# EAGLE design a26-flashcart (EAGLE 7.0.0)
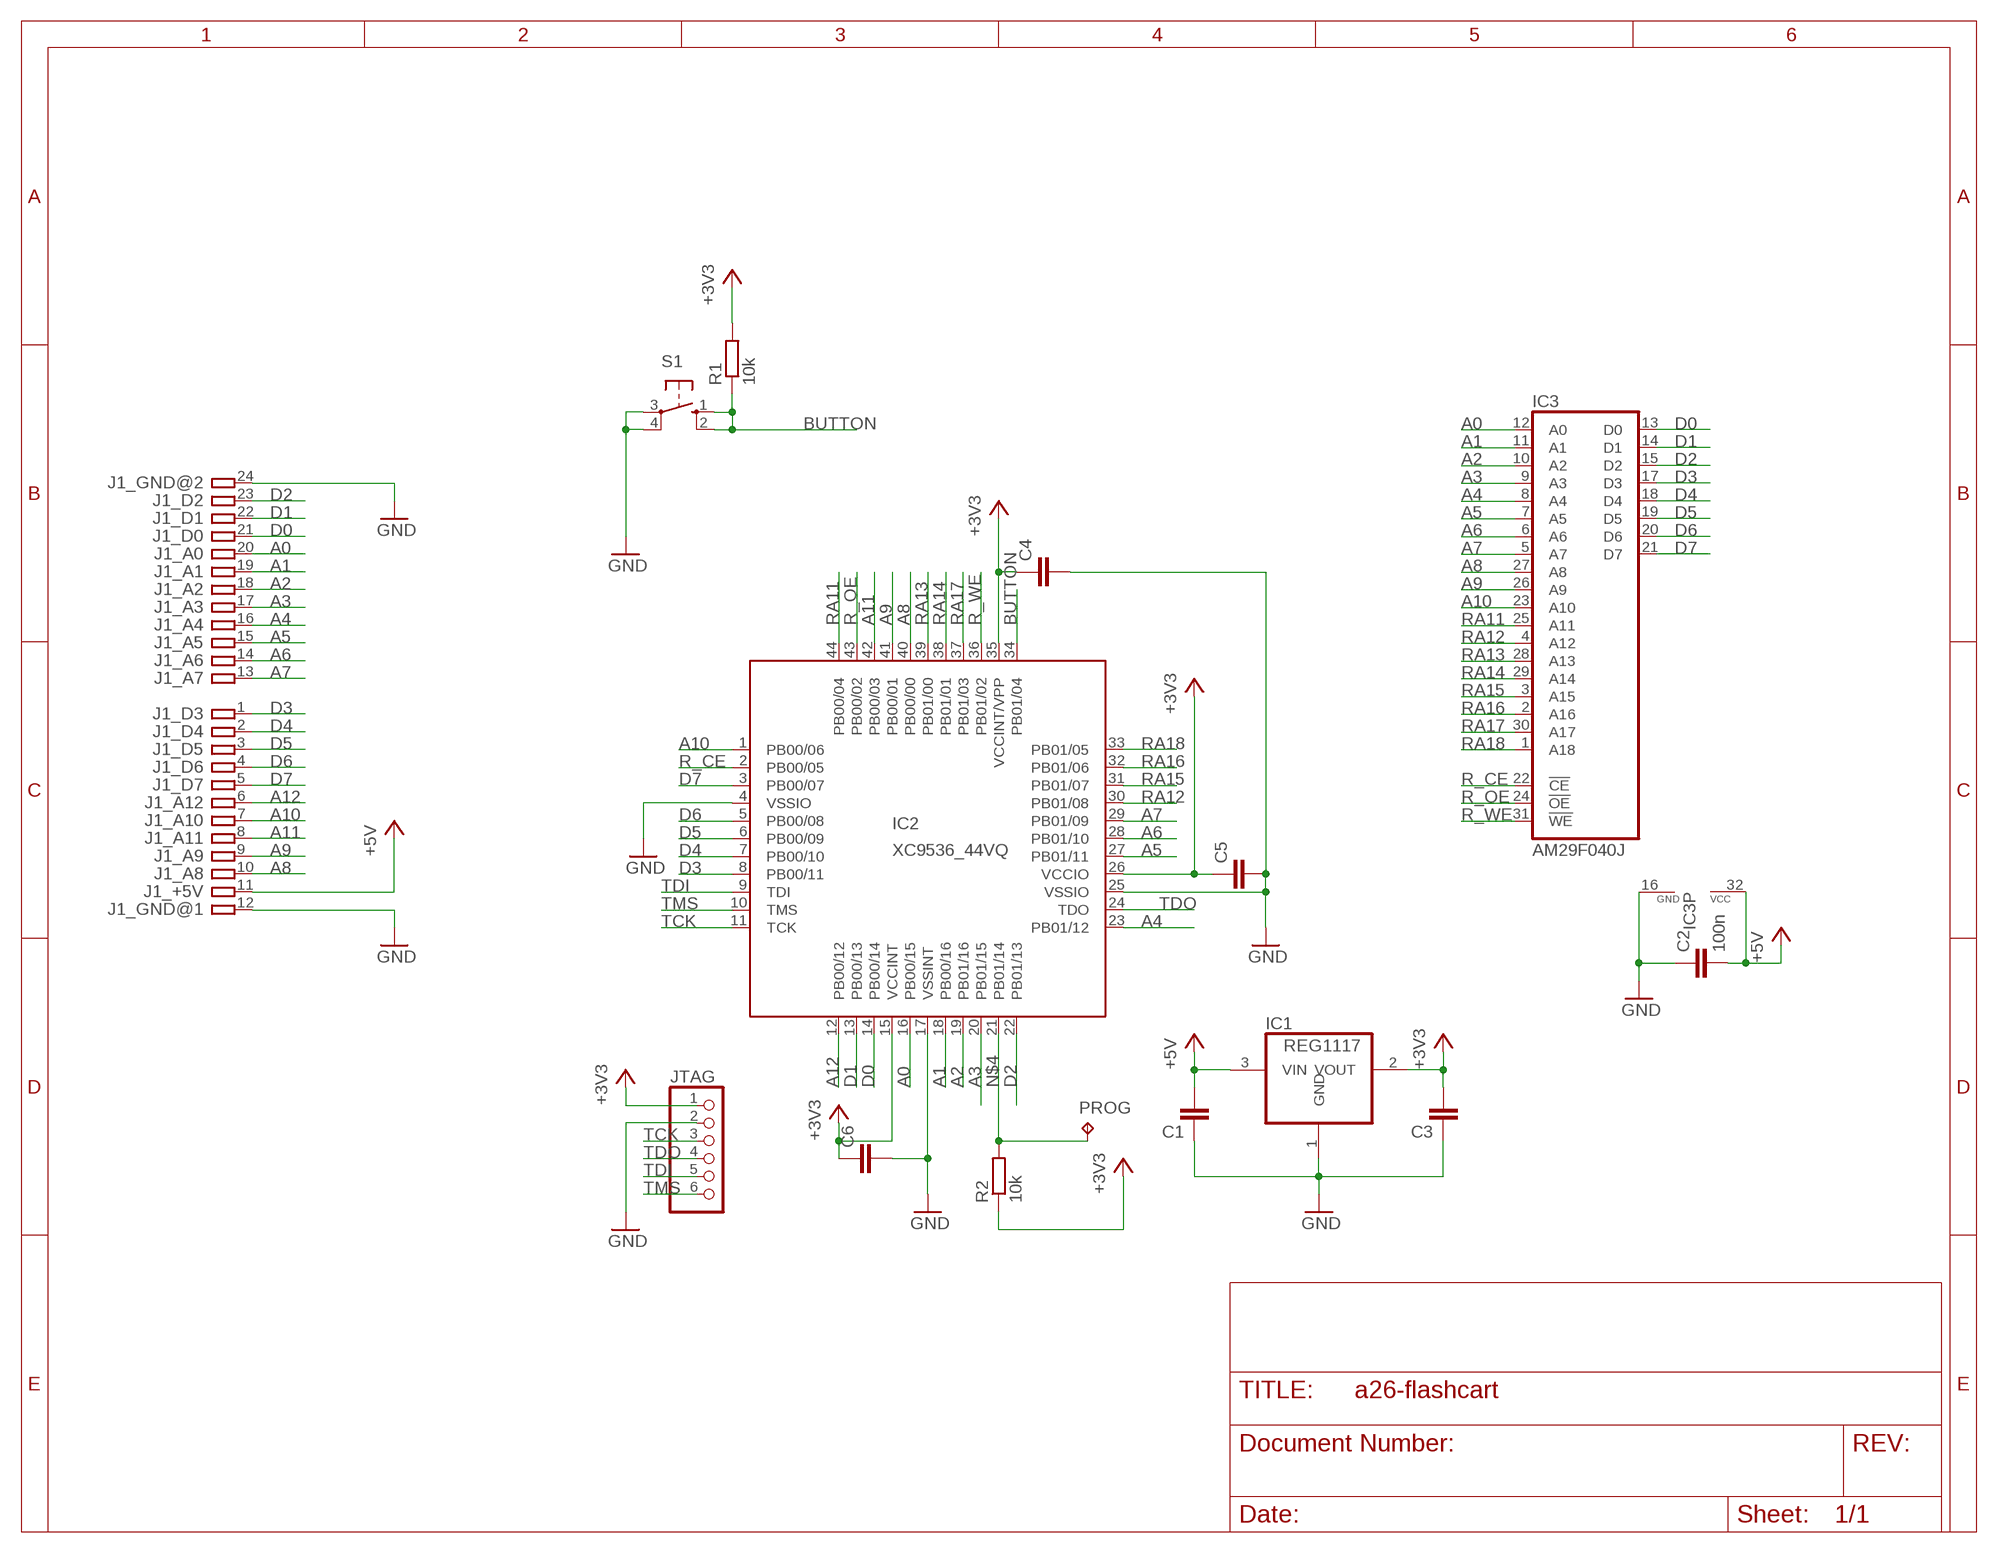
[diagram p0: schematic, sheet 1]

## Parts
C1  C-EUC0603  [C0603]
C2  100n  C-EUC0603  [C0603]
C3  C-EUC0603  [C0603]
C4  C-EUC0603  [C0603]
C5  C-EUC0603  [C0603]
C6  C-EUC0603  [C0603]
IC1  REG1117  [SOT223]
IC2  XC9536_44VQ  [SQFP-S-10X10-44]
IC3  AM29F040J  [PLCC32R]
J1  ATARI-2600-SMALL  [ATARI-2600-SMALL]
JTAG  PINHD-1X6  [1X06]
PROG  TPTP15R  [TP15R]
R1  10k  R-EU_R0603  [R0603]
R2  10k  R-EU_R0603  [R0603]
S1  10-XX  [B3F-10XX]

## Nets
+3V3: C3.2 C4.1 C5.1 C6.1 IC1.2(VOUT) IC2.15(VCCINT) IC2.26(VCCIO) IC2.35(VCCINT/VPP) JTAG.1 R1.2 R2.1
+5V: C1.2 C2.2 IC1.3(VIN) IC3.32(VCC) J1.11
A0: IC2.16(PB00/15) IC3.12(A0) J1.20
A1: IC2.18(PB00/16) IC3.11(A1) J1.19
A2: IC2.19(PB01/16) IC3.10(A2) J1.18
A3: IC2.20(PB01/15) IC3.9(A3) J1.17
A4: IC2.23(PB01/12) IC3.8(A4) J1.16
A5: IC2.27(PB01/11) IC3.7(A5) J1.15
A6: IC2.28(PB01/10) IC3.6(A6) J1.14
A7: IC2.29(PB01/09) IC3.5(A7) J1.13
A8: IC2.40(PB00/00) IC3.27(A8) J1.10
A9: IC2.41(PB00/01) IC3.26(A9) J1.9
A10: IC2.1(PB00/06) IC3.23(A10) J1.7
A11: IC2.42(PB00/03) J1.8
A12: IC2.12(PB00/12) J1.6
BUTTON: IC2.34(PB01/04) R1.1 S1.1(S) S1.2(S1)
D0: IC2.14(PB00/14) IC3.13(D0) J1.21
D1: IC2.13(PB00/13) IC3.14(D1) J1.22
D2: IC2.22(PB01/13) IC3.15(D2) J1.23
D3: IC2.8(PB00/11) IC3.17(D3) J1.1
D4: IC2.7(PB00/10) IC3.18(D4) J1.2
D5: IC2.6(PB00/09) IC3.19(D5) J1.3
D6: IC2.5(PB00/08) IC3.20(D6) J1.4
D7: IC2.3(PB00/07) IC3.21(D7) J1.5
GND: C1.1 C2.1 C3.1 C4.2 C5.2 C6.2 IC1.1(GND) IC2.4(VSSIO) IC2.17(VSSINT) IC2.25(VSSIO) IC3.16(GND) J1.12 J1.24 JTAG.2 S1.3(P) S1.4(P1)
N$4: IC2.21(PB01/14) PROG.TP R2.2
R_CE: IC2.2(PB00/05) IC3.22(!CE)
R_OE: IC2.43(PB00/02) IC3.24(!OE)
R_WE: IC2.36(PB01/02) IC3.31(!WE)
RA11: IC2.44(PB00/04) IC3.25(A11)
RA12: IC2.30(PB01/08) IC3.4(A12)
RA13: IC2.39(PB01/00) IC3.28(A13)
RA14: IC2.38(PB01/01) IC3.29(A14)
RA15: IC2.31(PB01/07) IC3.3(A15)
RA16: IC2.32(PB01/06) IC3.2(A16)
RA17: IC2.37(PB01/03) IC3.30(A17)
RA18: IC2.33(PB01/05) IC3.1(A18)
TCK: IC2.11(TCK) JTAG.3
TDI: IC2.9(TDI) JTAG.5
TDO: IC2.24(TDO) JTAG.4
TMS: IC2.10(TMS) JTAG.6

## Library data of the parts
C1-C6 = resistor:C-EU: CAPACITOR, European symbol
IC1 = burr-brown:REG1117: 800mA and 1A Low Dropout (LDO) Positive Regulator 1.8V, 2.5V, 2.85V, 3.3V, 5V, and Adj; MPN: REG1117; OC_FARNELL: 1097566; OC_NEWARK: 14P6981
IC2 = xilinx-xc9:XC9536_44VQ: xc9536_pc44 XC9500 In-System Programmable CPLD Family Auto generated by make-symbol-device-package-bsdl.ulp Rev. 34 Source: xc9536_vq44.bsd; MPN: XC9536-15VQG44C; OC_FARNELL: 1193227; OC_NEWARK: 98K3377
IC3 = am29-memory:AM29F040J: 4-Megabit FLASH MEMORY (512 K x 8 bit) 5 V-only
J1 = atari-2600:ATARI-2600: Atari 2600 cartridge board
JTAG = adafruit:PINHD-1X6: PIN HEADER
PROG = testpad:TP: Test pad
R1 R2 = resistor:R-EU_: RESISTOR, European symbol
S1 = switch-omron:10-XX: OMRON SWITCH; MPN: B3F-1000; OC_FARNELL: 176432; OC_NEWARK: 36M3542

## Board
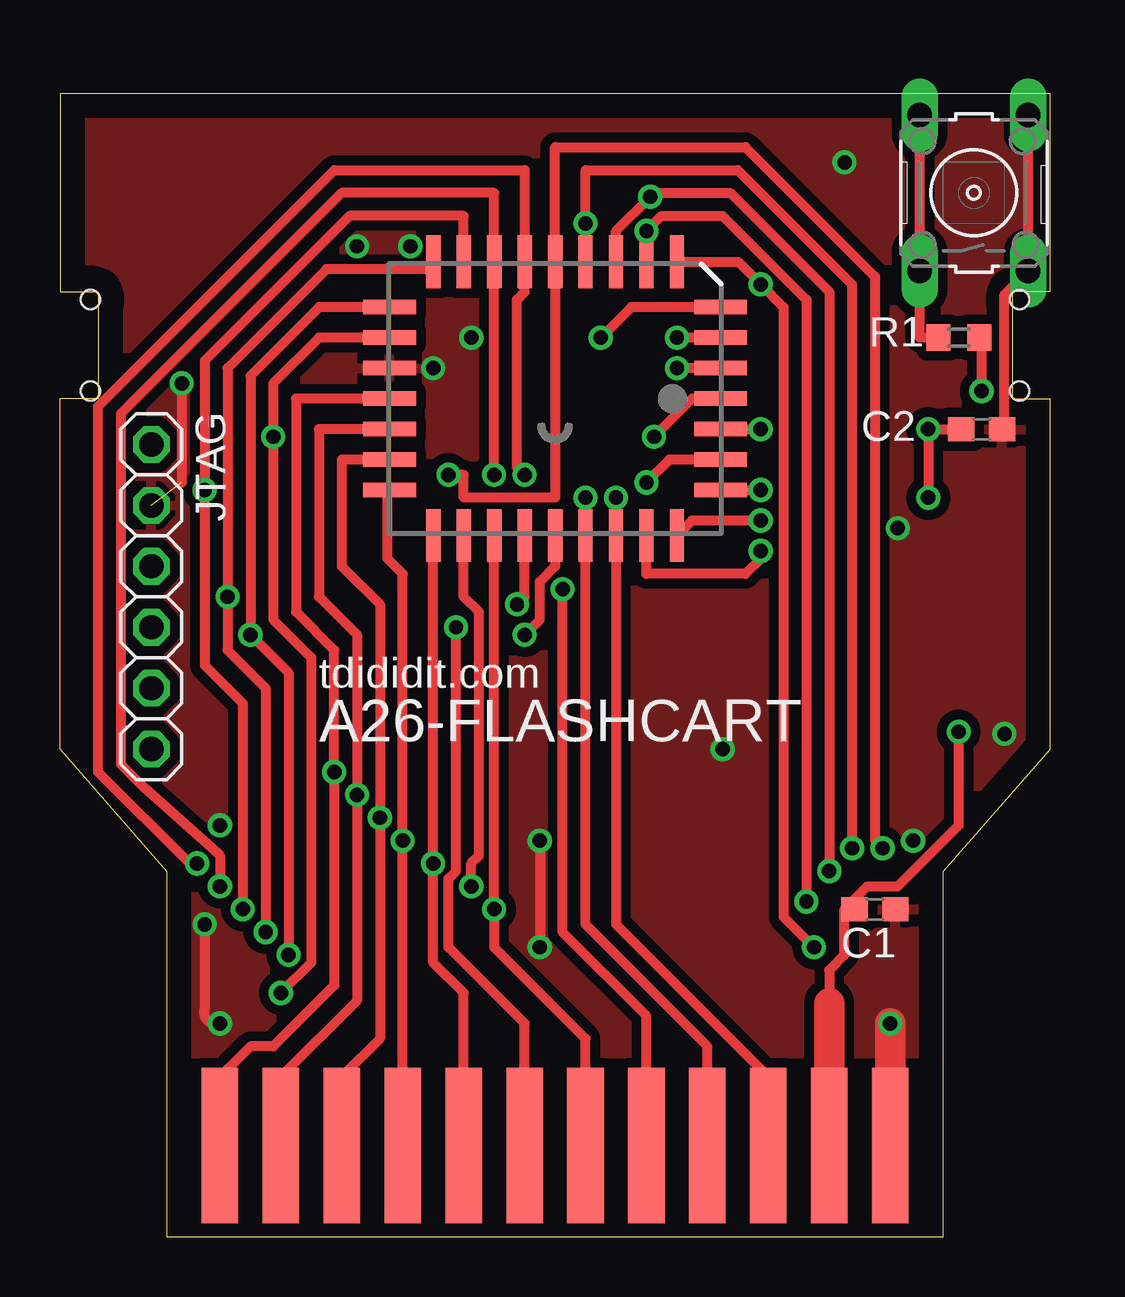
[diagram p1: board, top side]
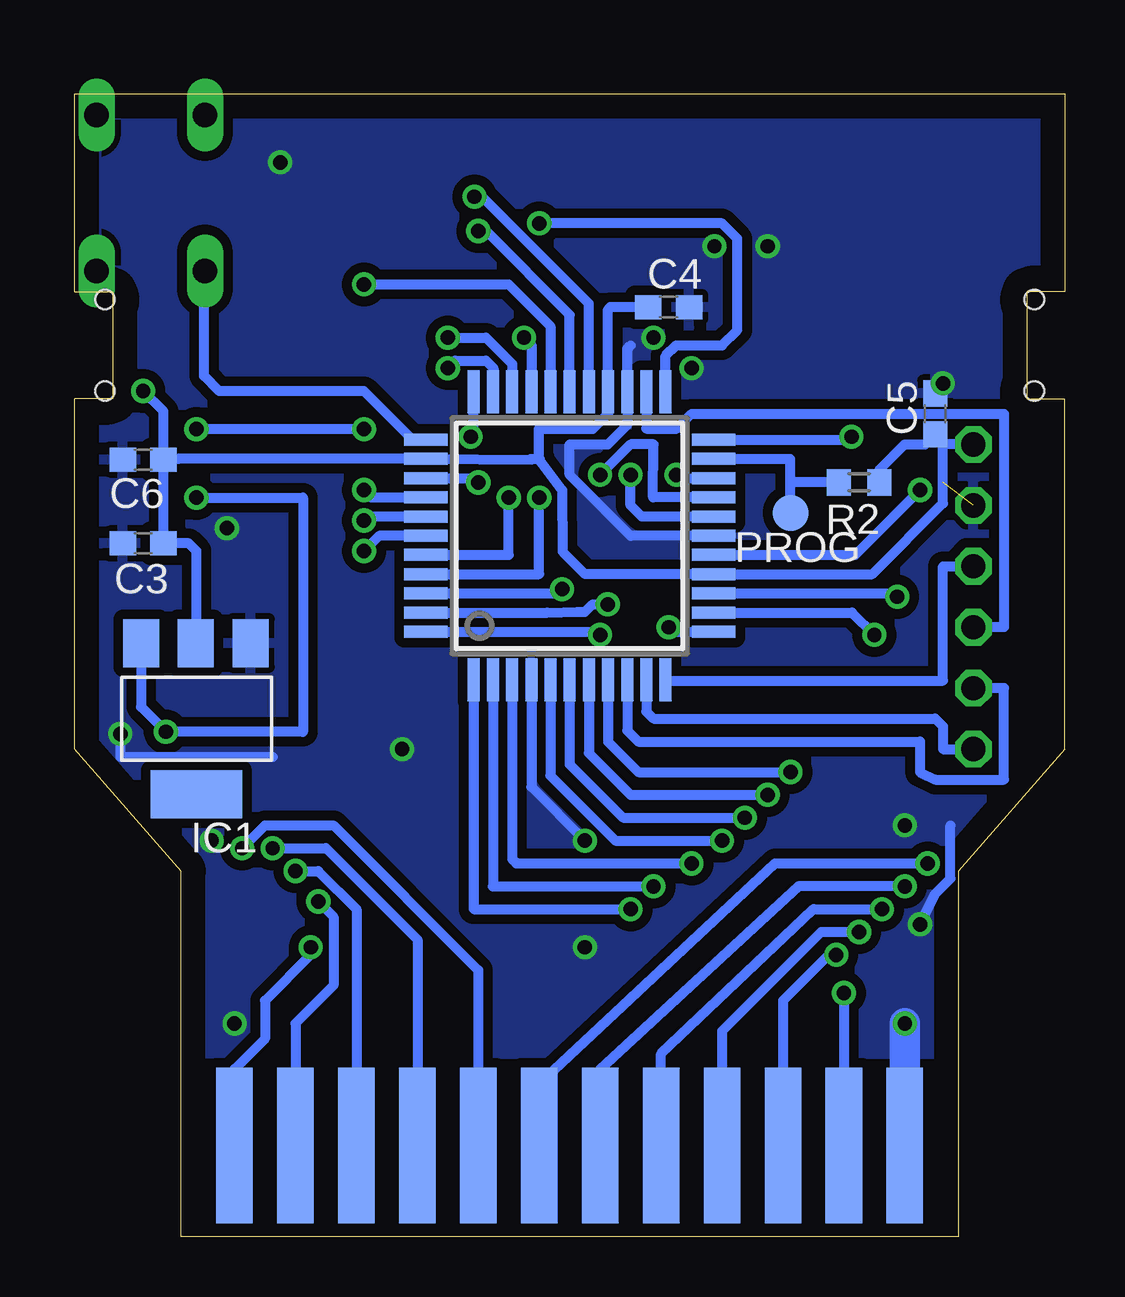
[diagram p2: board, bottom side, seen from below]

Size 41.27 x 47.62 mm. Coordinates in mm from the lower left corner, seen from the top.
Copper layers (1*16): Top 0.035mm / dielectric 1.5mm / Bottom 0.035mm
Design rules "default": minimum track width 10mil, minimum drill 24mil, track to track 8mil, track to pad 8mil, pad to pad 8mil, via to via 8mil, smd to smd 8mil, copper to edge 40mil, drill to drill 8mil, minimum pad ring 10mil, minimum via ring 8mil, stop-mask expansion 4mil, vias tented up to drill 0mil, thermal gap 10mil

### Footprints (pad centres in the part's own frame; a part is rotated, then mirrored left to right if it is on the bottom)
C0603 = smd 1.1 x 1: 1 -0.85,0; 2 0.85,0
SOT223 = smd 1.499 x 2.007: 1 -2.261,-3.15; 2 0.025,-3.15; 3 2.311,-3.15 | smd 3.81 x 2.007: 4 0,3.15
SQFP-S-10X10-44 = smd 0.5 x 1.8: 1 -4,-6; 2 -3.2,-6; 3 -2.4,-6; 4 -1.6,-6; 5 -0.8,-6; 6 0,-6; 7 0.8,-6; 8 1.6,-6; 9 2.4,-6; 10 3.2,-6; 11 4,-6; 23 4,6; 24 3.2,6; 25 2.4,6; 26 1.6,6; 27 0.8,6; 28 0,6; 29 -0.8,6; 30 -1.6,6; 31 -2.4,6; 32 -3.2,6; 33 -4,6 | smd 1.8 x 0.5: 12 6,-4; 13 6,-3.2; 14 6,-2.4; 15 6,-1.6; 16 6,-0.8; 17 6,0; 18 6,0.8; 19 6,1.6; 20 6,2.4; 21 6,3.2; 22 6,4; 34 -6,4; 35 -6,3.2; 36 -6,2.4; 37 -6,1.6; 38 -6,0.8; 39 -6,0; 40 -6,-0.8; 41 -6,-1.6; 42 -6,-2.4; 43 -6,-3.2; 44 -6,-4
PLCC32R = smd 0.6 x 2.2: 1 0,6.9; 2 -1.27,6.9; 3 -2.54,6.9; 4 -3.81,6.9; 14 -3.81,-6.9; 15 -2.54,-6.9; 16 -1.27,-6.9; 17 0,-6.9; 18 1.27,-6.9; 19 2.54,-6.9; 20 3.81,-6.9; 30 3.81,6.9; 31 2.54,6.9; 32 1.27,6.9 | smd 2.2 x 0.6: 5 -5.7,5.08; 6 -5.7,3.81; 7 -5.7,2.54; 8 -5.7,1.27; 9 -5.7,0; 10 -5.7,-1.27; 11 -5.7,-2.54; 12 -5.7,-3.81; 13 -5.7,-5.08; 21 5.7,-5.08; 22 5.7,-3.81; 23 5.7,-2.54; 24 5.7,-1.27; 25 5.7,0; 26 5.7,1.27; 27 5.7,2.54; 28 5.7,3.81; 29 5.7,5.08
ATARI-2600-SMALL = smd 1.524 x 6.477: 1 -13.97,3.81; 2 -11.43,3.81; 3 -8.89,3.81; 4 -6.35,3.81; 5 -3.81,3.81; 6 -1.27,3.81; 7 1.27,3.81; 8 3.81,3.81; 9 6.35,3.81; 10 8.89,3.81; 11 11.43,3.81; 12 13.97,3.81 | smd 1.524 x 6.477 bottom: 13 13.97,3.81; 14 11.43,3.81; 15 8.89,3.81; 16 6.35,3.81; 17 3.81,3.81; 18 1.27,3.81; 19 -1.27,3.81; 20 -3.81,3.81; 21 -6.35,3.81; 22 -8.89,3.81; 23 -11.43,3.81; 24 -13.97,3.81 | hole 0.8: -19.367,39.053; -19.367,35.242; 19.367,39.053; 19.367,35.242
1X06 = drill 1.016 octagon: 1 -6.35,0; 2 -3.81,0; 3 -1.27,0; 4 1.27,0; 5 3.81,0; 6 6.35,0
TP15R = smd 1.5 x 1.5: TP 0,0
R0603 = smd 1 x 1.1: 1 -0.85,0; 2 0.85,0
B3F-10XX = drill 1.016 long: 1 -3.251,2.261; 2 3.251,2.261; 3 -3.251,-2.261; 4 3.251,-2.261

### Placement (x,y rotation side)
C1  33.97,13.65 180 top
C2  38.42,33.66 180 top
C3  38.42,28.89 0 bottom
C4  16.51,38.73 0 bottom
C5  5.4,34.29 90 bottom
C6  38.42,32.38 180 bottom
IC1  36.2,21.59 180 bottom
IC2  20.64,29.21 0 bottom
IC3  20.64,34.93 270 top
J1  20.64,0 0 top
JTAG  3.81,26.67 270 top
PROG  11.43,30.16 0 bottom
R1  37.47,37.47 0 top
R2  8.57,31.43 180 bottom
S1  38.1,43.5 90 top

### Tracks (layer width: path | path; a pad name or v marks a point on that pad's centre or on a via)
+3V3  (via drill 0.6)
  Top 0.406: v38.42,35.24 38.42,37.36 R1.2
  Bottom 0.406: C6.1 36.96,32.41 IC2.35 22.23,32.38 | 22.25,32.41 22.23,32.38 | 22.23,32.38 22.2,32.41 21.93,32.41 | 21.93,32.41 21.88,32.41 | 21.93,32.41 21.91,32.38 20.96,31.12 20.93,28.55 19.99,27.61 IC2.15 8.03,27.61 5.08,30.56 5.08,33.02 | IC1.2 36.2,24.76 36.2,28.58 36.51,28.89 C3.2 C6.1 | C6.1 37.57,34.39 v38.42,35.24 | C4.1 18.95,38.73 19.04,38.65 IC2.26 19.04,34.3 19.68,33.65 21.93,33.65 21.93,32.41 | JTAG.1 5.08,33.02 | 5.08,33.02 C5.1 5.82,33.02 6.67,33.02 7.72,31.97 R2.1
+5V  (via drill 0.6)
  Top 0.406: 32.7,13.65 32.7,11.75 32.07,11.11 32.07,8.57 | 32.7,13.65 33.66,14.6 34.92,14.6 37.47,17.15 v37.47,21.04 | v36.2,30.8 v36.2,33.65 C2.2 | IC3.32 v29.21,33.65 | C1.2 32.7,13.65
  Top 1.27: J1.11 32.07,8.57 32.07,9.74
  Bottom 0.406: 37.78,21.04 v37.47,21.04 | v36.2,30.8 31.75,30.8 31.75,21.04 v37.47,21.04 | v29.21,33.65 v36.2,33.65 | IC1.3 38.51,22.09 v37.47,21.04
A0  (via drill 0.6)
  Top 0.406: IC3.12 16.83,42.55 12.06,42.55 6.03,36.51 v6.03,31.12 6.03,23.81 7.62,22.22 v7.62,13.65
  Bottom 0.406: J1.20 16.83,7.62 10.48,13.65 v7.62,13.65 | IC2.16 8.74,28.41 v6.03,31.12
A1  (via drill 0.6)
  Top 0.406: v6.67,14.6 6.67,15.87 6.35,16.19 3.49,18.73 2.54,19.69 2.54,34.29 11.75,43.5 18.1,43.5 IC3.11 v18.1,31.75
  Bottom 0.406: v6.67,14.6 11.11,14.6 19.37,6.98 J1.19 | IC2.18 17.63,30.01 18.1,30.48 v18.1,31.75
A2  (via drill 0.6)
  Top 0.406: v5.71,15.56 5.4,15.56 1.59,19.37 1.59,34.61 11.43,44.45 19.37,44.45 IC3.10 19.37,39.37 19.05,39.05 19.05,32.07 v19.37,31.75
  Bottom 0.406: J1.18 21.91,6.35 12.06,15.56 v5.71,15.56 | IC2.19 17.16,30.81 17.14,33.02 18.1,33.02 v19.37,31.75
A3  (via drill 0.6)
  Top 0.406: v34.29,16.19 33.97,16.51 33.97,40.01 28.58,45.4 20.64,45.4 IC3.9 20.64,30.8 16.83,30.8 16.83,31.75 v16.19,31.75
  Bottom 0.406: v34.29,16.19 33.34,17.15 30.48,17.15 24.45,11.11 J1.17 | v16.19,31.75 16.05,31.61 IC2.20
A4  (via drill 0.6)
  Top 0.406: v33.02,16.19 33.02,39.69 28.26,44.45 21.91,44.45 v21.91,42.23 IC3.8
  Bottom 0.406: v33.02,16.19 30.8,16.19 26.99,12.38 J1.16 | IC2.23 16.64,36.7 16.19,37.15 14.29,37.15 13.65,37.78 13.65,41.59 14.29,42.23 v21.91,42.23
A5  (via drill 0.6)
  Top 0.406: IC3.7 23.18,41.91 v24.61,43.34 24.77,43.5 27.94,43.5 32.07,39.37 v32.07,15.24
  Bottom 0.406: v32.07,15.24 31.12,15.24 29.53,13.65 J1.15 | IC2.27 19.84,38.89 24.29,43.34 v24.61,43.34
A6  (via drill 0.6)
  Top 0.406: v31.12,13.97 31.12,39.05 27.62,42.55 25.08,42.55 v24.45,41.91 IC3.6
  Bottom 0.406: v31.12,13.97 30.48,13.33 30.48,10.48 32.07,8.89 J1.14 | IC2.28 20.64,38.42 24.13,41.91 v24.45,41.91
A7  (via drill 0.6)
  Top 0.406: v31.43,12.06 30.16,13.33 30.16,38.73 v29.21,39.69 28.27,40.62 IC3.5
  Bottom 0.406: v31.43,12.06 31.43,11.75 33.34,9.84 33.34,8.25 34.61,6.98 J1.13 | v29.21,39.69 23.18,39.69 21.44,37.95 IC2.29
A8  (via drill 0.6)
  Top 0.406: J1.10 29.53,6.67 23.18,13.02 IC3.27 v23.18,30.8
  Bottom 0.406: IC2.40 23.18,28.41 v23.18,30.8
A9  (via drill 0.6)
  Top 0.406: J1.9 26.99,7.94 21.91,13.02 IC3.26 v21.91,30.8
  Bottom 0.406: IC2.41 21.91,27.61 v21.91,30.8
A10  (via drill 0.6)
  Top 0.406: J1.7 21.91,8.25 18.1,12.06 v18.1,13.65 IC3.23
  Bottom 0.406: IC2.1 24.64,13.65 v18.1,13.65
A11  (via drill 0.6)
  Top 0.406: J1.8 24.45,9.21 20.96,12.7 v20.96,26.99
  Bottom 0.406: IC2.42 21.09,26.81 v20.96,26.99
A12  (via drill 0.6)
  Top 0.406: J1.6 19.37,8.89 16.19,12.06 16.19,14.92 16.51,15.24 v16.51,25.4
  Bottom 0.406: v16.51,25.4 16.38,25.21 IC2.12
BUTTON
  Top 0.406: R1.1 35.84,37.47 S1.1 S1.2
  Bottom 0.406: IC2.34 27.18,33.21 29.21,35.24 35.24,35.24 35.88,35.88 35.88,40.21 S1.1
D0  (via drill 0.6)
  Top 0.406: IC3.13 15.25,40.32 11.11,40.32 6.98,36.19 v6.98,26.67 6.98,24.45 8.57,22.86 v8.57,12.7
  Bottom 0.406: v8.57,12.7 10.16,12.7 14.29,8.57 J1.21 | IC2.14 7.12,26.81 v6.98,26.67
D1  (via drill 0.6)
  Top 0.406: IC3.14 10.79,38.73 7.94,35.88 v7.94,25.08 9.53,23.49 v9.53,11.75
  Bottom 0.406: v9.53,11.75 9.84,11.75 11.75,9.84 J1.22 | IC2.13 8.86,26.01 v7.94,25.08
D2  (via drill 0.6)
  Top 0.406: IC3.15 10.79,37.47 8.89,35.56 v8.89,33.34 8.89,25.72 10.48,24.13 10.48,11.43 v9.21,10.16
  Bottom 0.406: v9.21,10.16 J1.23 | IC2.22 9.02,33.21 v8.89,33.34
D3  (via drill 0.6)
  Top 0.406: IC3.17 9.84,34.93 9.84,26.03 11.43,24.45 v11.43,19.37 11.43,10.48 8.89,7.94 7.94,7.94 6.98,6.98 6.98,4.13 J1.1
  Bottom 0.406: IC2.8 19.04,20.62 17.78,19.37 v11.43,19.37
D4  (via drill 0.6)
  Top 0.406: IC3.18 10.79,33.65 10.79,26.67 12.38,25.08 v12.38,18.42 12.38,9.84 9.21,6.67 J1.2
  Bottom 0.406: IC2.7 19.84,20.15 18.1,18.42 v12.38,18.42
D5  (via drill 0.6)
  Top 0.406: IC3.19 11.75,32.38 11.75,27.94 13.34,26.35 v13.34,17.46 13.34,8.25 11.75,6.67 J1.3
  Bottom 0.406: IC2.6 20.64,19.69 18.41,17.46 v13.34,17.46
D6  (via drill 0.6)
  Top 0.406: J1.4 v14.29,16.51 14.29,27.62 13.65,28.26 13.65,31.03 IC3.20
  Bottom 0.406: IC2.5 21.44,19.21 18.73,16.51 v14.29,16.51
D7  (via drill 0.6)
  Top 0.406: J1.5 16.83,10.16 15.56,11.43 v15.56,15.56 IC3.21
  Bottom 0.406: IC2.3 23.04,15.74 22.86,15.56 v15.56,15.56
GND  (via drill 0.6)  (1 unrouted)
  Top 0.406: v6.03,13.02 6.03,9.53 arc90 6.35,8.89 v6.67,8.89 | C2.1 arc90 39.37,33.76 39.37,39.26 S1.3 S1.4 | v20,16.51 v20,12.06 | v5.08,35.56 5.08,31.43
  Top 1.27: J1.12 v34.61,8.89
  Bottom 0.406: v39.37,20.96 39.37,20 33.02,20 | 18.1,37.15 18.24,37.01 IC2.25 18.24,33.83 19.05,33.02 20.64,33.02 20.64,31.75 18.1,29.21 IC2.17 | C4.2 15.56,38.73 | v6.03,13.02 5.4,14.29 4.76,14.92 4.76,17.15 | IC2.4 22.24,18.74 v20,16.51 | v5.08,35.56 5.4,35.24 C5.2
  Bottom 1.27: J1.24 v6.67,8.89
  other vias: 34.92,29.53 35.56,16.51 6.67,17.15 15.56,36.2 14.61,41.27 12.38,41.27 27.62,20.32 17.14,37.47 32.7,44.77
  pour Top (isolate 0.406): 0.32,48.26 40.96,48.26 40.96,19.05 37.15,15.24 37.15,7.62 4.13,7.62 4.13,16.51 0.32,20.32
  pour Bottom (isolate 0.406): 0.32,48.26 40.96,48.26 40.96,19.05 37.15,15.24 37.15,7.62 4.13,7.62 4.13,16.51 0.32,20.32
N$4
  Bottom 0.406: IC2.21 11.45,32.41 11.45,31.43 | 11.45,31.43 11.45,30.19 PROG.TP | R2.2 11.45,31.43
R_CE  (via drill 0.6)
  Top 0.406: v17.14,14.6 17.14,15.56 17.46,15.87 17.46,26.03 16.83,26.67 IC3.22
  Bottom 0.406: IC2.2 23.84,14.6 v17.14,14.6
R_OE  (via drill 0.6)
  Top 0.406: v19.05,26.35 19.37,26.67 IC3.24
  Bottom 0.406: IC2.43 21.57,26.01 20.32,26.03 20,26.03 19.68,26.35 v19.05,26.35
R_WE  (via drill 0.6)
  Top 0.406: IC3.31 25.4,32.38 v24.45,31.43
  Bottom 0.406: IC2.36 24.59,31.61 v24.45,31.43
RA11  (via drill 0.6)
  Top 0.406: IC3.25 20.64,27.94 20,27.3 20,25.72 v19.37,25.08
  Bottom 0.406: IC2.44 19.56,25.21 v19.37,25.08
RA12  (via drill 0.6)
  Top 0.406: IC3.4 23.81,38.73 v22.54,37.47
  Bottom 0.406: v22.54,37.47 22.24,37.16 IC2.30
RA13  (via drill 0.6)
  Top 0.406: v29.21,28.58 29.21,28.26 28.58,27.62 24.45,27.62 IC3.28
  Bottom 0.406: IC2.39 28.58,29.21 v29.21,28.58
RA14  (via drill 0.6)
  Top 0.406: v29.21,29.85 26.34,29.85 IC3.29
  Bottom 0.406: IC2.38 29.05,30.01 v29.21,29.85
RA15  (via drill 0.6)
  Top 0.406: IC3.3 v25.72,37.47
  Bottom 0.406: v25.72,37.47 24.13,37.47 23.04,36.37 IC2.31
RA16  (via drill 0.6)
  Top 0.406: IC3.2 v25.72,36.19
  Bottom 0.406: v25.72,36.19 25.4,36.51 24.13,36.51 23.81,36.19 23.81,35.23 IC2.32
RA17  (via drill 0.6)
  Top 0.406: IC3.30 v29.21,31.12
  Bottom 0.406: v29.21,31.12 28.91,30.81 IC2.37
RA18  (via drill 0.6)
  Top 0.406: IC3.1 26.35,34.93 v24.77,33.34
  Bottom 0.406: v24.77,33.34 24.64,33.47 IC2.33
TCK
  Bottom 0.406: JTAG.3 5.08,27.94 5.08,23.18 16.61,23.18 IC2.11
TDI
  Bottom 0.406: IC2.9 18.24,21.1 17.78,20.64 6.03,20.64 6.03,19.37 5.4,19.05 2.54,19.05 2.54,22.86 JTAG.5
TDO
  Bottom 0.406: IC2.24 17.44,33.68 16.17,33.68 15.56,34.29 2.54,34.29 2.54,25.4 JTAG.4
TMS
  Bottom 0.406: IC2.10 17.44,21.88 17.14,21.59 5.4,21.59 5.08,21.27 5.08,20.32 JTAG.6

### Text on the board
tPlace: tdididit.com | A26-FLASHCART